# Altium schematic sheet Sheet1.SchDoc
size A4
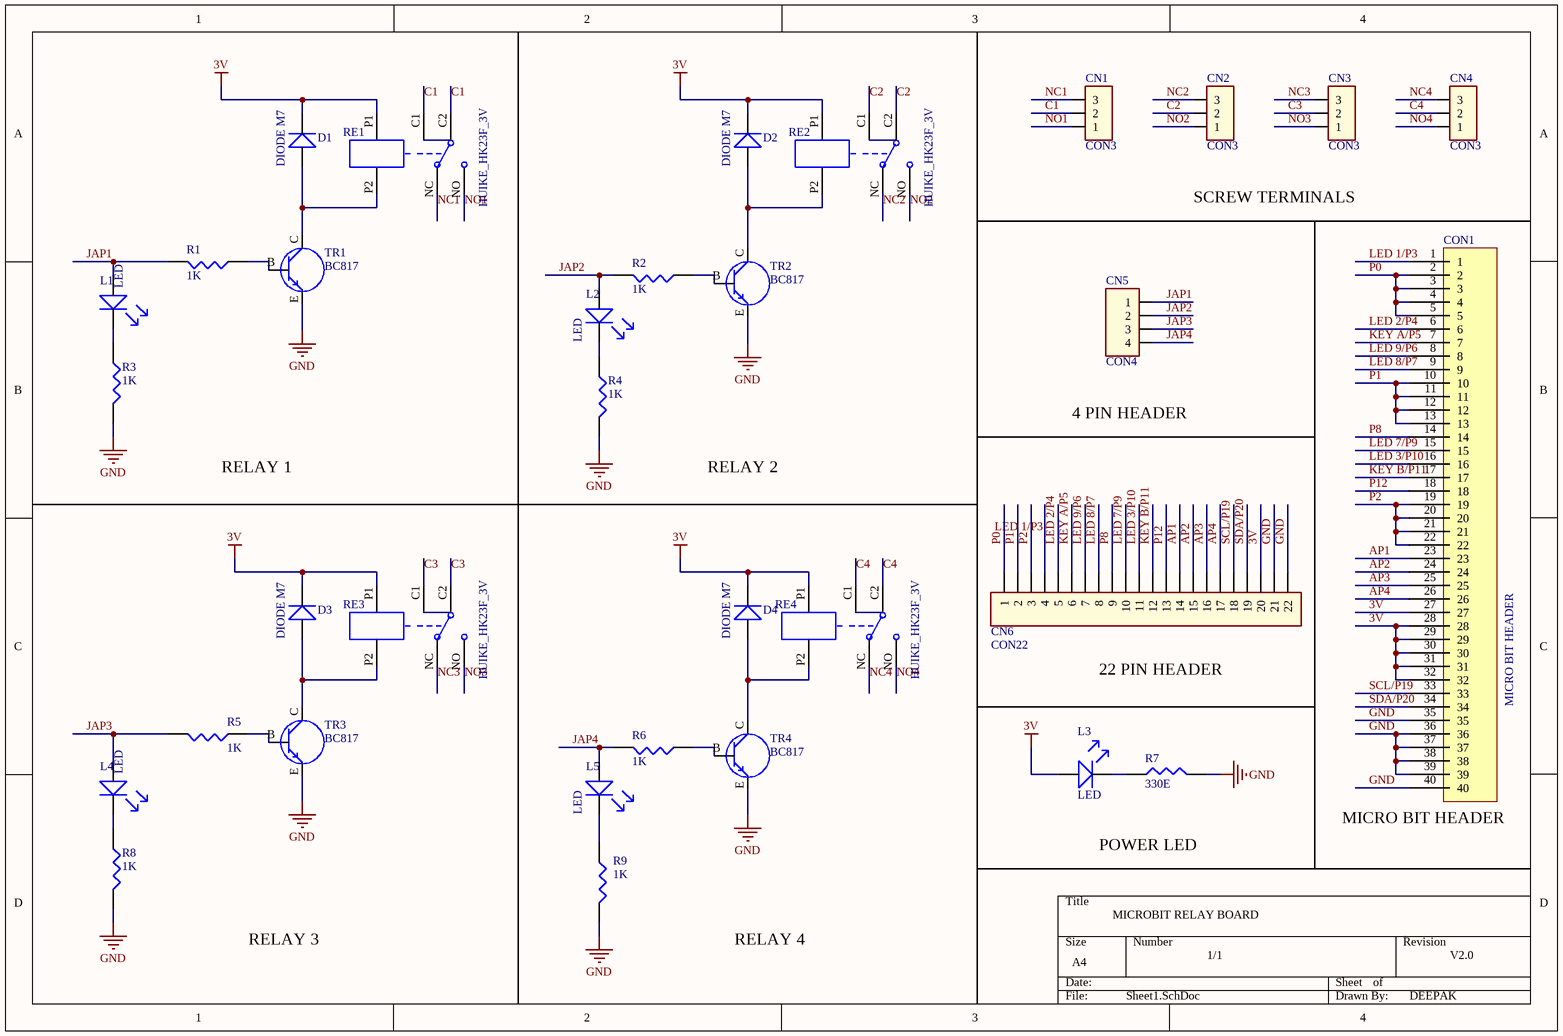
[diagram p0: Sheet1.SchDoc]

## Parts
CN1  CON3  [CON3_3.5]
CN2  CON3  [CON3_3.5]
CN3  CON3  [CON3_3.5]
CN4  CON3  [CON3_3.5]
CN5  CON4  [CON4_BJ]
CN6  CON22  [CON22  berg]
CON1  MICRO BIT HEADER  [MICROBIT HEADER STRAIGHT]
D1  DIODE M7  [M7 SMO_DO-214AC]
D2  DIODE M7  [M7 SMO_DO-214AC]
D3  DIODE M7  [M7 SMO_DO-214AC]
D4  DIODE M7  [M7 SMO_DO-214AC]
L1  LED  [0805 _LED]
L2  LED  [0805 _LED]
L3  LED  [0805 _LED]
L4  LED  [0805 _LED]
L5  LED  [0805 _LED]
R1  1K  [0603]
R2  1K  [0603]
R3  1K  [0603]
R4  1K  [0603]
R5  1K  [0603]
R6  1K  [0603]
R7  330E  [0603]
R8  1K  [0603]
R9  1K  [0603]
RE1  HUIKE_HK23F_3V  [HK23F_RELAY]
RE2  HUIKE_HK23F_3V  [HK23F_RELAY]
RE3  HUIKE_HK23F_3V  [HK23F_RELAY]
RE4  HUIKE_HK23F_3V  [HK23F_RELAY]
TR1  BC817  [547_SOT23]
TR2  BC817  [547_SOT23]
TR3  BC817  [547_SOT23]
TR4  BC817  [547_SOT23]

## Nets
3V: CN6.20 CON1.27 CON1.28 CON1.29 CON1.30 CON1.31 CON1.32 D1.K D2.K D3.K D4.K L3.A RE1.P1 RE2.P1 RE3.P1 RE4.P1
GND: CN6.21 CN6.22 CON1.35 CON1.36 CON1.37 CON1.38 CON1.39 CON1.40 R3.2 R4.2 R7.2 R8.2 R9.2 TR1.E TR2.E TR3.E TR4.E
AP1: CN6.14 CON1.23
AP2: CN6.15 CON1.24
AP3: CN6.16 CON1.25
AP4: CN6.17 CON1.26
C1: CN1.2 RE1.C1 RE1.C2
C2: CN2.2 RE2.C1 RE2.C2
C3: CN3.2 RE3.C1 RE3.C2
C4: CN4.2 RE4.C1 RE4.C2
JAP1: CN5.1 L1.A R1.2
JAP2: CN5.2 L2.A R2.2
JAP3: CN5.3 L4.A R5.2
JAP4: CN5.4 L5.A R6.2
KEY A/P5: CN6.6 CON1.7
KEY B/P11: CN6.12 CON1.17
LED 1/P3: CN6.4 CON1.1
LED 2/P4: CN6.5 CON1.6
LED 3/P10: CN6.11 CON1.16
LED 7/P9: CN6.10 CON1.15
LED 8/P7: CN6.8 CON1.9
LED 9/P6: CN6.7 CON1.8
NC1: CN1.3 RE1.NC
NC2: CN2.3 RE2.NC
NC3: CN3.3 RE3.NC
NC4: CN4.3 RE4.NC
NO1: CN1.1 RE1.NO
NO2: CN2.1 RE2.NO
NO3: CN3.1 RE3.NO
NO4: CN4.1 RE4.NO
P0: CN6.1 CON1.2 CON1.3 CON1.4 CON1.5
P1: CN6.2 CON1.10 CON1.11 CON1.12 CON1.13
P2: CN6.3 CON1.19 CON1.20 CON1.21 CON1.22
P8: CN6.9 CON1.14
P12: CN6.13 CON1.18
SCL/P19: CN6.18 CON1.33
SDA/P20: CN6.19 CON1.34
NetD1_A: D1.A RE1.P2 TR1.C
NetD2_A: D2.A RE2.P2 TR2.C
NetD3_A: D3.A RE3.P2 TR3.C
NetD4_A: D4.A RE4.P2 TR4.C
NetL1_K: L1.K R3.1
NetL2_K: L2.K R4.1
NetL3_K: L3.K R7.1
NetL4_K: L4.K R8.1
NetL5_K: L5.K R9.1
NetR1_1: R1.1 TR1.B
NetR2_1: R2.1 TR2.B
NetR5_1: R5.1 TR3.B
NetR6_1: R6.1 TR4.B

## Notes on the sheet
- SCREW TERMINALS
- 4 PIN HEADER
- RELAY 1
- RELAY 2
- 22 PIN HEADER
- POWER LED
- (near CON1) MICRO BIT HEADER
- MICROBIT RELAY BOARD
- RELAY 3
- RELAY 4
- 1/1
- V2.0
- DEEPAK

## Library data of the parts
CON1 = MICRO BIT HEADER 40 PIN
D1-D4 = DIODE
R1-R9 = RES
TR1-TR4 = TRANSISTER_NPN